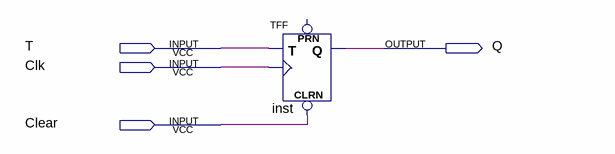
[diagram p0: schematic sheet]
// Quartus schematic Block3.bdf as structural Verilog: 1 symbols, 4 pins
module Block3 (
  input  T,
  input  Clk,
  input  Clear,
  output Q
);

  TFF inst (.CLRN(Clear), .T(T), .CLK(Clk), .Q(Q));  // open: PRN
endmodule
